# EAGLE design pc_afe4400_shield (EAGLE 6.4)

## Sheet 1 of 2
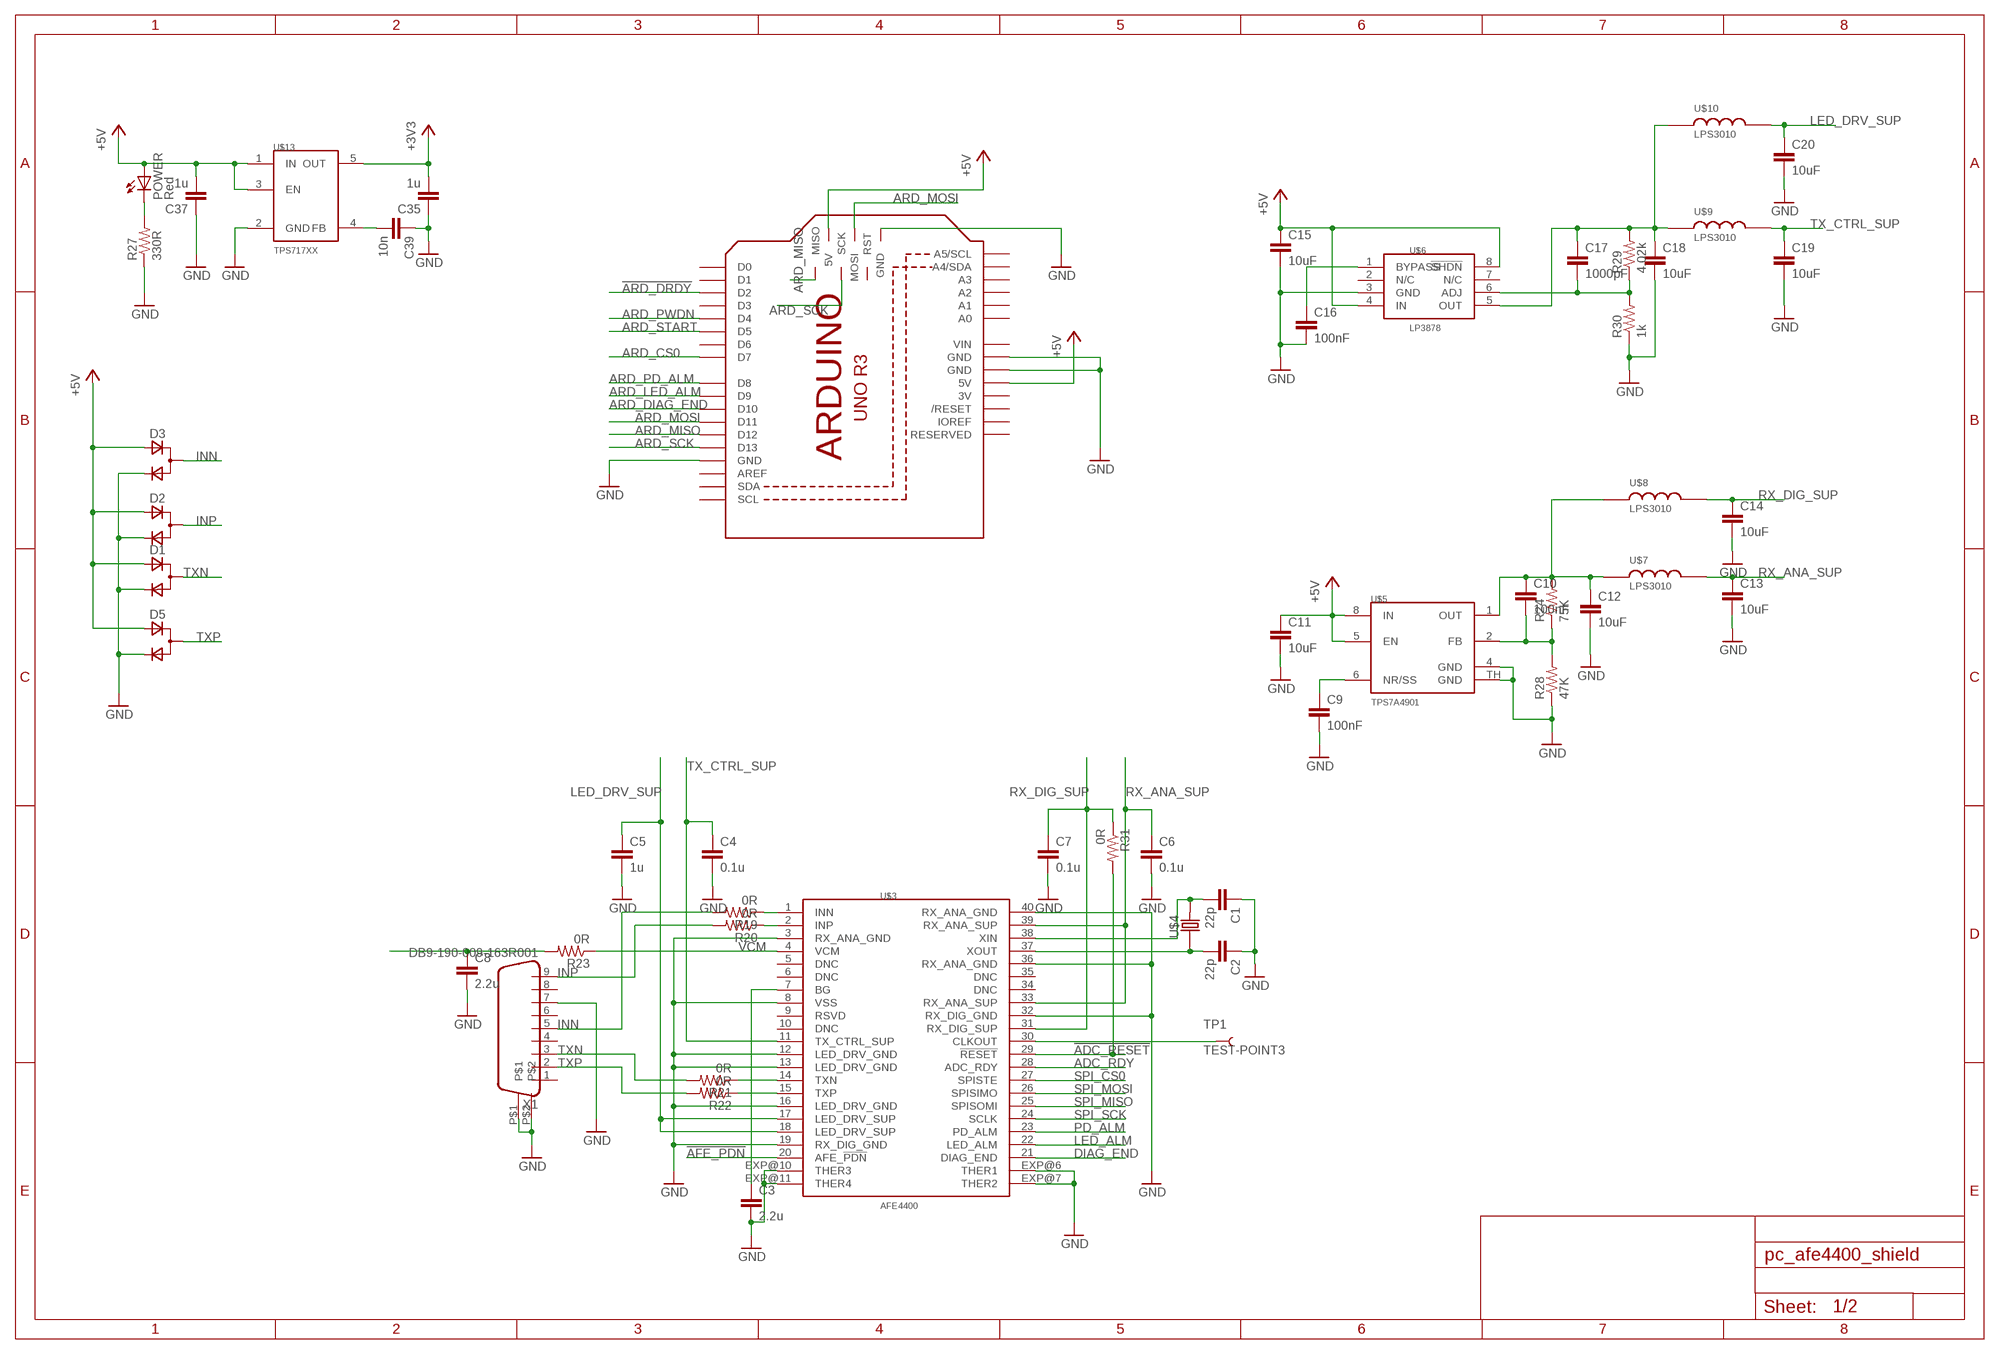
[diagram p0: schematic, sheet 1]

### Parts
C1  22p  C-EUC0402  [C0402]
C2  22p  C-EUC0402  [C0402]
C3  2.2u  C-EUC0402  [C0402]
C4  0.1u  C-EUC0805  [C0805]
C5  1u  C-EUC0805  [C0805]
C6  0.1u  C-EUC0805  [C0805]
C7  0.1u  C-EUC0805  [C0805]
C8  2.2u  C-EUC0402  [C0402]
C9  100nF  C-EUC0805  [C0805]
C10  100nF  C-EUC0805  [C0805]
C11  10uF  C-EUC0805  [C0805]
C12  10uF  C-EUC0805  [C0805]
C13  10uF  C-EUC0805  [C0805]
C14  10uF  C-EUC0805  [C0805]
C15  10uF  C-EUC0805  [C0805]
C16  100nF  C-EUC0805  [C0805]
C17  1000pF  C-EUC0805  [C0805]
C18  10uF  C-EUC0805  [C0805]
C19  10uF  C-EUC0805  [C0805]
C20  10uF  C-EUC0805  [C0805]
C35  1u  C-EUC0805  [C0805]
C37  1u  C-EUC0805  [C0805]
C39  10n  C-EUC0805  [C0805]
D1  D_ACACSOT323  [SOT323]
D2  D_ACACSOT323  [SOT323]
D3  D_ACACSOT323  [SOT323]
D5  D_ACACSOT323  [SOT323]
M1  ARDUINO  [ARDUINO]
POWER  Red  LEDCHIPLED_0603  [CHIPLED_0603]
R19  0R  R-US_R0402  [R0402]
R20  0R  R-US_R0402  [R0402]
R21  0R  R-US_R0805  [R0805]
R22  0R  R-US_R0805  [R0805]
R23  0R  R-US_R0402  [R0402]
R24  75K  R-US_R0805  [R0805]
R27  330R  R-US_R0805  [R0805]
R28  47K  R-US_R0805  [R0805]
R29  4.02k  R-US_R0805  [R0805]
R30  1k  R-US_R0805  [R0805]
R31  0R  R-US_R0805  [R0805]
TP1  TEST-POINT3  [PAD.03X.03]
U$3  AFE4400  [QFN-40]
U$4  ABM3  [ABM3]
U$5  TPS7A4901  [S-PDSO-G08]
U$6  LP3878  [DDA]
U$7  LPS3010  LPS  [LPS]
U$8  LPS3010  LPS  [LPS]
U$9  LPS3010  LPS  [LPS]
U$10  LPS3010  LPS  [LPS]
U$13  TPS717XX  [SC70-5]
X1  DB9-190-009-163R001  [DB9-190-009-163R001]

### Nets
!ADC_RESET: R31.2 U$3.29(!RESET) ; also sheet 2
!AFE_PDN: U$3.20(AFE_!PDN) ; also sheet 2
!ARD_DRDY: M1.D2 ; also sheet 2
+3V3: C35.2 U$13.5(OUT) ; also sheet 2
+5V: C11.1 C15.1 C37.2 D1.3(A) D2.3(A) D3.3(A) D5.3(A) M1.5V M1.5V_ICSP(5V) POWER.A U$5.5(EN) U$5.8(IN) U$6.4(IN) U$6.8(!SHDN) U$13.1(IN) U$13.3(EN) ; also sheet 2
ADC_RDY: U$3.28(ADC_RDY) ; also sheet 2
ARD_CS0: M1.D7 ; also sheet 2
ARD_DIAG_END: M1.D10 ; also sheet 2
ARD_LED_ALM: M1.D9 ; also sheet 2
ARD_MISO: M1.D12 M1.MISO ; also sheet 2
ARD_MOSI: M1.D11 M1.MOSI ; also sheet 2
ARD_PD_ALM: M1.D8 ; also sheet 2
ARD_PWDN: M1.D4 ; also sheet 2
ARD_SCK: M1.D13 M1.SCK ; also sheet 2
ARD_START: M1.D5 ; also sheet 2
DIAG_END: U$3.21(DIAG_END) ; also sheet 2
GND: C1.1 C2.1 C3.2 C4.2 C5.2 C6.2 C7.2 C8.2 C9.2 C11.2 C12.2 C13.2 C14.2 C15.2 C16.2 C18.2 C19.2 C20.2 C35.1 C37.1 C39.1 D1.2(C) D2.2(C) D3.2(C) D5.2(C) M1.GND M1.GND@1(GND) M1.GND@2(GND) M1.GND@3(GND) R27.1 R28.1 R30.1 U$3.3(RX_ANA_GND) U$3.8(VSS) U$3.12(LED_DRV_GND) U$3.13(LED_DRV_GND) U$3.16(LED_DRV_GND) U$3.19(RX_DIG_GND) U$3.32(RX_DIG_GND) U$3.36(RX_ANA_GND) U$3.40(RX_ANA_GND) U$3.EXP@6(THER1) U$3.EXP@7(THER2) U$3.EXP@10(THER3) U$3.EXP@11(THER4) U$5.4(GND) U$5.TH(GND) U$6.3(GND) U$13.2(GND) X1.7 X1.P$1 X1.P$2
INN: D3.1(CA) R19.2 X1.5
INP: D2.1(CA) R20.2 X1.9
LED_ALM: U$3.22(LED_ALM) ; also sheet 2
LED_DRV_SUP: C5.1 C20.1 U$3.17(LED_DRV_SUP) U$3.18(LED_DRV_SUP) U$10.2
N$1: C39.2 U$13.4(FB)
N$2: C3.1 U$3.7(BG)
N$4: R21.1 U$3.14(TXN)
N$5: TP1.P$1 U$3.30(CLKOUT)
N$6: R22.1 U$3.15(TXP)
N$7: POWER.C R27.2
N$8: R19.1 U$3.1(INN)
N$9: C8.1 R23.2
N$10: C1.2 U$3.38(XIN) U$4.2
N$11: C2.2 U$3.37(XOUT) U$4.1
N$14: C16.1 U$6.1(BYPASS)
N$15: C9.1 U$5.6(NR/SS)
N$16: C17.1 C18.1 R29.2 U$6.5(OUT) U$9.1 U$10.1
N$17: R20.1 U$3.2(INP)
N$19: C10.1 C12.1 R24.2 U$5.1(OUT) U$7.1 U$8.1
N$20: C10.2 R24.1 R28.2 U$5.2(FB)
N$22: C17.2 R29.1 R30.2 U$6.6(ADJ)
PD_ALM: U$3.23(PD_ALM) ; also sheet 2
RX_ANA_SUP: C6.1 C13.1 U$3.33(RX_ANA_SUP) U$3.39(RX_ANA_SUP) U$7.2
RX_DIG_SUP: C7.1 C14.1 R31.1 U$3.31(RX_DIG_SUP) U$8.2
SPI_CS0: U$3.27(SPISTE) ; also sheet 2
SPI_MISO: U$3.25(SPISOMI) ; also sheet 2
SPI_MOSI: U$3.26(SPISIMO) ; also sheet 2
SPI_SCK: U$3.24(SCLK) ; also sheet 2
TX_CTRL_SUP: C4.1 C19.1 U$3.11(TX_CTRL_SUP) U$9.2
TXN: D1.1(CA) R21.2 X1.3
TXP: D5.1(CA) R22.2 X1.2
VCM: R23.1 U$3.4(VCM)
Unconnected: M1.A0 M1.A1 M1.A2 M1.A3 M1.A4(A4/SDA) M1.A5(A5/SCL) M1.AREF M1.D0 M1.D1 M1.D3 M1.D6 M1.IOREF M1.RESERVED M1.RESET(/RESET) M1.RESET_ICSP(RST) M1.SCL M1.SDA U$3.5(DNC) U$3.6(DNC) U$3.9(RSVD) U$3.10(DNC) U$3.34(DNC) U$3.35(DNC) U$6.2(N/C) U$6.7(N/C) X1.1 X1.4 X1.6 X1.8

## Sheet 2 of 2
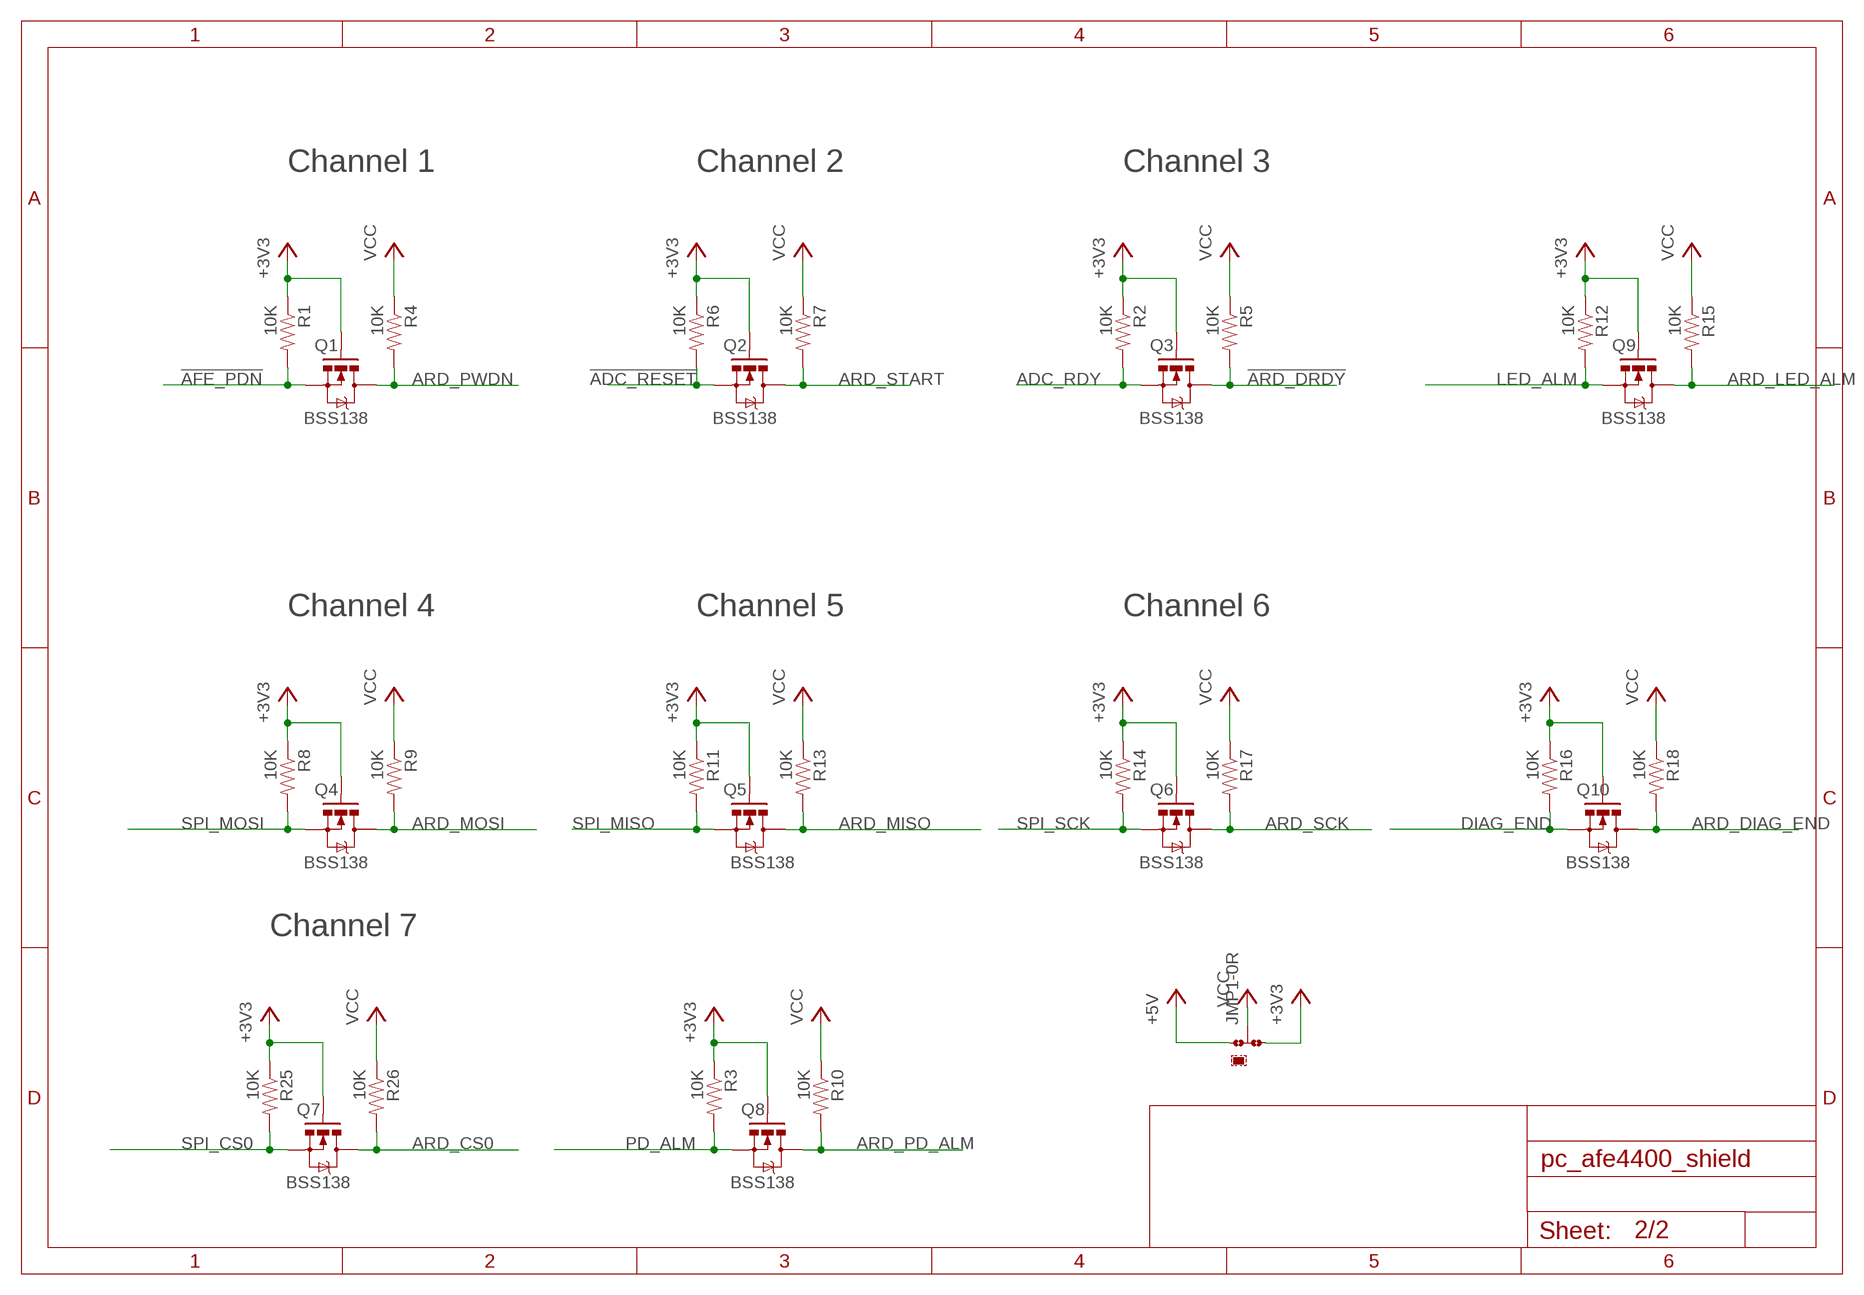
[diagram p1: schematic, sheet 2]

### Parts
JMP1  0R-JUMPA  [A0R-JMP]
Q1  BSS138  MOSFET-NCHANNELSMD  [SOT23-3]
Q2  BSS138  MOSFET-NCHANNELSMD  [SOT23-3]
Q3  BSS138  MOSFET-NCHANNELSMD  [SOT23-3]
Q4  BSS138  MOSFET-NCHANNELSMD  [SOT23-3]
Q5  BSS138  MOSFET-NCHANNELSMD  [SOT23-3]
Q6  BSS138  MOSFET-NCHANNELSMD  [SOT23-3]
Q7  BSS138  MOSFET-NCHANNELSMD  [SOT23-3]
Q8  BSS138  MOSFET-NCHANNELSMD  [SOT23-3]
Q9  BSS138  MOSFET-NCHANNELSMD  [SOT23-3]
Q10  BSS138  MOSFET-NCHANNELSMD  [SOT23-3]
R1  10K  RESISTOR0805-RES  [0805]
R2  10K  RESISTOR0805-RES  [0805]
R3  10K  RESISTOR0805-RES  [0805]
R4  10K  RESISTOR0805-RES  [0805]
R5  10K  RESISTOR0805-RES  [0805]
R6  10K  RESISTOR0805-RES  [0805]
R7  10K  RESISTOR0805-RES  [0805]
R8  10K  RESISTOR0805-RES  [0805]
R9  10K  RESISTOR0805-RES  [0805]
R10  10K  RESISTOR0805-RES  [0805]
R11  10K  RESISTOR0805-RES  [0805]
R12  10K  RESISTOR0805-RES  [0805]
R13  10K  RESISTOR0805-RES  [0805]
R14  10K  RESISTOR0805-RES  [0805]
R15  10K  RESISTOR0805-RES  [0805]
R16  10K  RESISTOR0805-RES  [0805]
R17  10K  RESISTOR0805-RES  [0805]
R18  10K  RESISTOR0805-RES  [0805]
R25  10K  RESISTOR0805-RES  [0805]
R26  10K  RESISTOR0805-RES  [0805]

### Nets
!ADC_RESET: Q2.2(S) R6.2 ; also sheet 1
!AFE_PDN: Q1.2(S) R1.2 ; also sheet 1
!ARD_DRDY: Q3.3(D) R5.2 ; also sheet 1
+3V3: JMP1.3 Q1.1(G) Q2.1(G) Q3.1(G) Q4.1(G) Q5.1(G) Q6.1(G) Q7.1(G) Q8.1(G) Q9.1(G) Q10.1(G) R1.1 R2.1 R3.1 R6.1 R8.1 R11.1 R12.1 R14.1 R16.1 R25.1 ; also sheet 1
+5V: JMP1.1 ; also sheet 1
ADC_RDY: Q3.2(S) R2.2 ; also sheet 1
ARD_CS0: Q7.3(D) R26.2 ; also sheet 1
ARD_DIAG_END: Q10.3(D) R18.2 ; also sheet 1
ARD_LED_ALM: Q9.3(D) R15.2 ; also sheet 1
ARD_MISO: Q5.3(D) R13.2 ; also sheet 1
ARD_MOSI: Q4.3(D) R9.2 ; also sheet 1
ARD_PD_ALM: Q8.3(D) R10.2 ; also sheet 1
ARD_PWDN: Q1.3(D) R4.2 ; also sheet 1
ARD_SCK: Q6.3(D) R17.2 ; also sheet 1
ARD_START: Q2.3(D) R7.2 ; also sheet 1
DIAG_END: Q10.2(S) R16.2 ; also sheet 1
LED_ALM: Q9.2(S) R12.2 ; also sheet 1
PD_ALM: Q8.2(S) R3.2 ; also sheet 1
SPI_CS0: Q7.2(S) R25.2 ; also sheet 1
SPI_MISO: Q5.2(S) R11.2 ; also sheet 1
SPI_MOSI: Q4.2(S) R8.2 ; also sheet 1
SPI_SCK: Q6.2(S) R14.2 ; also sheet 1
VCC: JMP1.2 R4.1 R5.1 R7.1 R9.1 R10.1 R13.1 R15.1 R17.1 R18.1 R26.1

### Notes on the sheet
- Channel 1 | Channel 2 | Channel 3
- Channel 4 | Channel 5 | Channel 6
- Channel 7

## Power pins joined to a net without a drawn wire
3V: M1.3V
VIN: M1.VIN

## Library data of the parts
C1-C20 C35 C37 C39 = rcl:C-EU: CAPACITOR, European symbol
D1-D3 D5 = zetex:D_ACAC: Dual DIODE; OC_FARNELL: unknown; OC_NEWARK: unknown
JMP1 = jump-0r-smd:0R-JUMP: SMD 0R 0805 Jumper
M1 = circuitects:ARDUINO
POWER = led:LED: LED OSRAM: - CHIPLED LG R971, LG N971, LY N971, LG Q971, LY Q971, LO R971, LY R971 LH N974, LH R974 LS Q976, LO Q976, LY Q976 LO Q996 - Hyper CHIPLED LW Q18S LB Q993, LB Q99A, LB R99A - SideLED LS A670, LO A670, LY A670, LG A670, LP A670 LB A673, LV A673, LT A673, LW A673 LH A674 LY A675 LS A676, LA A676, LO A676, LY A676, LW A676 LS A679, LY A679, LG A679 - Hyper Micro SIDELED® LS Y876, LA Y876, LO Y876, LY Y876 LT Y87S - SmartLED LW L88C, LW L88S LB L89C, LB L89S, LG L890 LS L89K, LO L89K, LY L89K LS L896, LA L896, LO L896, LY L896 - TOPLED LS T670, LO T670, LY T670, LG T670, LP T670 LSG T670, LSP T670, LSY T670, LOP T670, LYG T670 LG T671, LOG T671, LSG T671 LB T673, LV T673, LT T673, LW T673 LH T674 LS T676, LA T676, LO T676, LY T676, LB T676, LH T676, LSB T676, LW T676 LB T67C, LV T67C, LT T67C, LS T67K, LO T67K, LY T67K, LW E67C LS E67B, LA E67B, LO E67B, LY E67B, LB E67C, LV E67C, LT E67C LW T67C LS T679, LY T679, LG T679 LS T770, LO T770, LY T770, LG T770, LP T770 LB T773, LV T773, LT T773, LW T773 LH T774 LS E675, LA E675, LY E675, LS T675 LS T776, LA T776, LO T776, LY T776, LB T776 LHGB T686 LT T68C, LB T68C - Hyper Mini TOPLED® LB M676 - Mini TOPLED Santana® LG M470 LS M47K, LO M47K, LY M47K Source: http://www.osram.convergy.de LUXEON: - LUMILED® LXK2-PW12-R00, LXK2-PW12-S00, LXK2-PW14-U00, LXK2-PW14-V00 LXK2-PM12-R00, LXK2-PM12-S00, LXK2-PM14-U00 LXK2-PE12-Q00, LXK2-PE12-R00, LXK2-PE12-S00, LXK2-PE14-T00, LXK2-PE14-U00 LXK2-PB12-K00, LXK2-PB12-L00, LXK2-PB12-M00, LXK2-PB14-N00, LXK2-PB14-P00, LXK2-PB14-Q00 LXK2-PR12-L00, LXK2-PR12-M00, LXK2-PR14-Q00, LXK2-PR14-R00 LXK2-PD12-Q00, LXK2-PD12-R00, LXK2-PD12-S00 LXK2-PH12-R00, LXK2-PH12-S00 LXK2-PL12-P00, LXK2-PL12-Q00, LXK2-PL12-R00 Source: www.luxeon.com KINGBRIGHT: KA-3528ASYC Source: www.kingbright.com
Q1-Q10 = SparkFun:MOSFET-NCHANNEL
R1-R18 R25 R26 = SparkFun:RESISTOR: Resistor Basic schematic elements and footprints for 0603, 1206, and PTH resistors.
R19-R24 R27-R31 = rcl:R-US_: RESISTOR, American symbol
TP1 = SparkFun:TEST-POINT
U$3 = circuitects:AFE4400
U$4 = circuitects:ABM3
U$5 = circuitects:TPS7A4901
U$6 = circuitects:LP3878
U$7-U$10 = circuitects:LPS
U$13 = circuitects:TPS717XX
X1 = circuitects:DB9-190-009-163R001

## Board
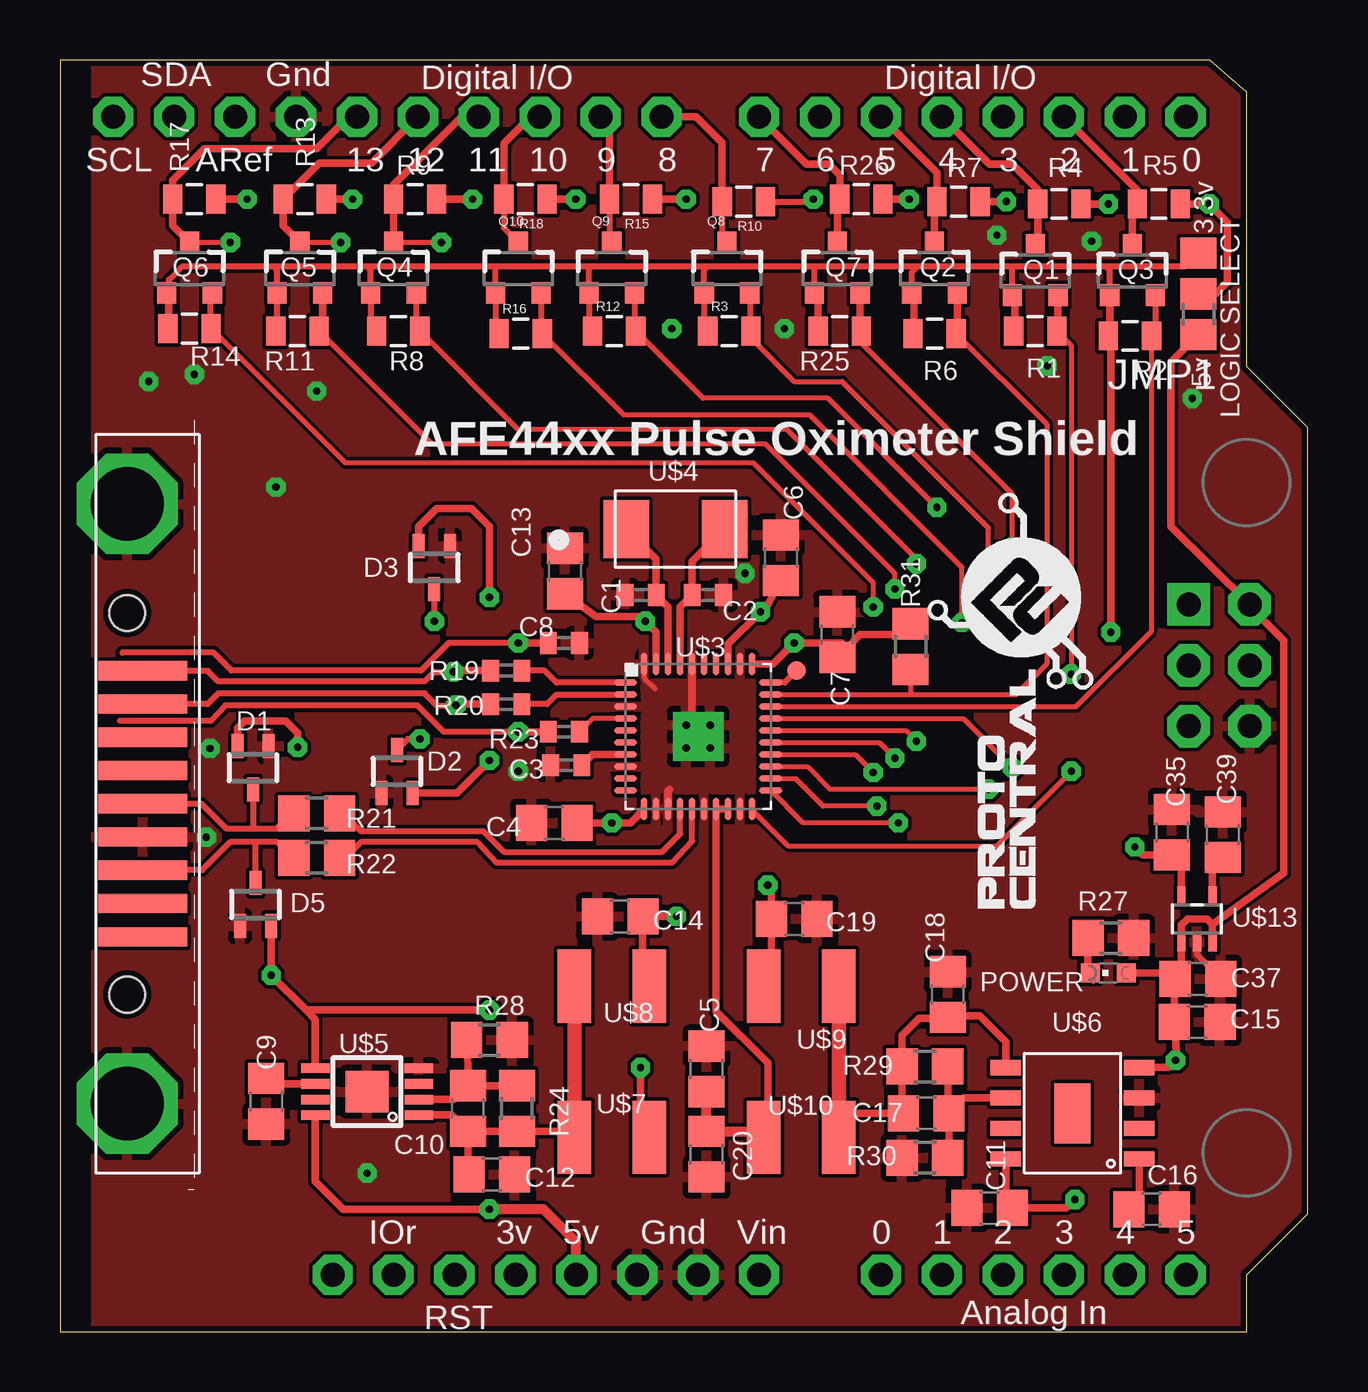
[diagram p2: board, top side]
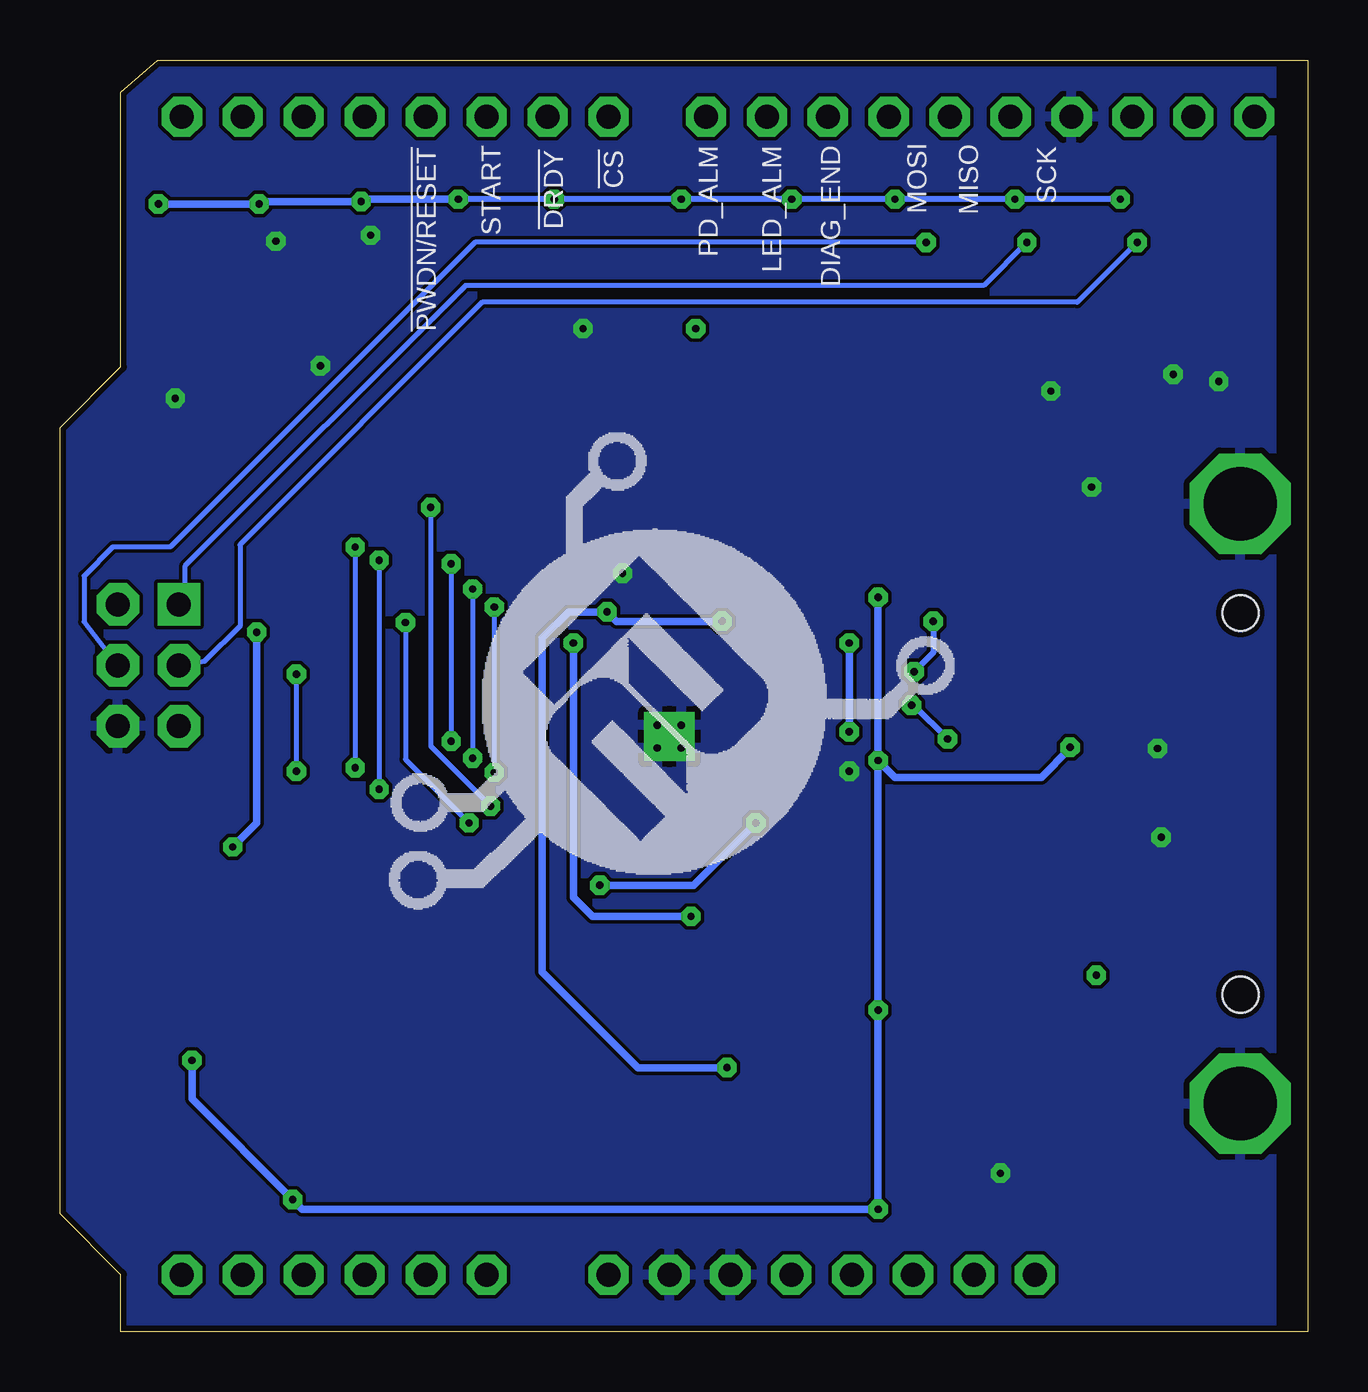
[diagram p3: board, bottom side, seen from below]

Size 52 x 53 mm. Coordinates in mm from the lower left corner, seen from the top.
Copper layers (1*2*15*16): Top 0.035mm / dielectric 1.5mm / Route2 0.035mm / dielectric 0.15mm / Route15 0.035mm / dielectric 0.2mm / Bottom 0.035mm
Design rules "Circuitects-Rules": minimum track width 6mil, minimum drill 0.3mm, track to track 6mil, track to pad 6mil, pad to pad 6mil, via to via 6mil, smd to smd 6mil, copper to edge 10mil, drill to drill 8mil, minimum pad ring 12mil, minimum via ring 10mil, stop-mask expansion 4mil, vias tented up to drill 25mil, thermal gap 10mil

### Footprints (pad centres in the part's own frame; a part is rotated, then mirrored left to right if it is on the bottom)
C0402 = smd 0.7 x 0.9: 1 -0.65,0; 2 0.65,0
C0805 = smd 1.3 x 1.5: 1 -0.95,0; 2 0.95,0
SOT323 = smd 0.5 x 1: 1 0,0.9; 2 -0.65,-0.9; 3 0.65,-0.9
A0R-JMP = smd 1.5 x 1.3: 1 0,1.7; 2 0,0; 3 0,-1.7
ARDUINO = drill 1 pad 1.676 octagon: 3V 18.96,2.34; 5V 21.5,2.34; A0 34.2,2.34; A1 36.74,2.34; A2 39.28,2.34; A3 41.82,2.34; A4 44.36,2.34; A5 46.9,2.34; AREF 7.276,50.6; D0 46.9,50.6; D1 44.36,50.6; D2 41.82,50.6; D3 39.28,50.6; D4 36.74,50.6; D5 34.2,50.6; D6 31.66,50.6; D7 29.12,50.6; D8 25.056,50.6; D9 22.516,50.6; D10 19.976,50.6; D11 17.436,50.6; D12 14.896,50.6; D13 12.356,50.6; GND 9.816,50.6; GND@1 26.58,2.34; GND@2 24.04,2.34; IOREF 13.88,2.34; RESERVED 11.34,2.34; RESET 16.42,2.34; SCL 2.196,50.6; SDA 4.736,50.6; VIN 29.12,2.34 | drill 1 pad 1.778 octagon: 5V_ICSP 49.567,30.28; GND@3 49.567,25.2; MOSI 49.567,27.74; RESET_ICSP 47.027,25.2; SCK 47.027,27.74 | drill 1 pad 1.778 square: MISO 47.027,30.28
CHIPLED_0603 = smd 0.8 x 0.8: A 0,-0.75; C 0,0.75
SOT23-3 = smd 0.8 x 0.9: 1 -0.95,-1; 2 0.95,-1; 3 0,1.1
0805 = smd 0.8 x 1.2: 1 -0.9,0; 2 0.9,0
R0402 = smd 0.7 x 0.9: 1 -0.65,0; 2 0.65,0
R0805 = smd 1.3 x 1.5: 1 -0.95,0; 2 0.95,0
PAD.03X.03 = smd 0.762 x 0.762: P$1 0,0
QFN-40 = smd 0.95 x 0.28: 1 -3.025,2.25; 2 -3.025,1.75; 3 -3.025,1.25; 4 -3.025,0.75; 5 -3.025,0.25; 6 -3.025,-0.25; 7 -3.025,-0.75; 8 -3.025,-1.25; 9 -3.025,-1.75; 10 -3.025,-2.25; 21 3.025,-2.25; 22 3.025,-1.75; 23 3.025,-1.25; 24 3.025,-0.75; 25 3.025,-0.25; 26 3.025,0.25; 27 3.025,0.75; 28 3.025,1.25; 29 3.025,1.75; 30 3.025,2.25 | smd 0.28 x 0.95: 11 -2.25,-3.025; 12 -1.75,-3.025; 13 -1.25,-3.025; 14 -0.75,-3.025; 15 -0.25,-3.025; 16 0.25,-3.025; 17 0.75,-3.025; 18 1.25,-3.025; 19 1.75,-3.025; 20 2.25,-3.025; 31 2.25,3.025; 32 1.75,3.025; 33 1.25,3.025; 34 0.75,3.025; 35 0.25,3.025; 36 -0.25,3.025; 37 -0.75,3.025; 38 -1.25,3.025; 39 -1.75,3.025; 40 -2.25,3.025 | drill 0.3 pad 1.1 square: EXP@6 -0.5,0.475; EXP@7 0.5,0.475; EXP@10 -0.5,-0.475; EXP@11 0.5,-0.475
ABM3 = smd 1.9 x 2.4: 1 -2.05,0; 2 2.05,0
S-PDSO-G08 = smd 0.4 x 1.2: 1 -0.975,-2.157; 2 -0.325,-2.157; 3 0.325,-2.157; 4 0.975,-2.157; 5 0.975,2.157; 6 0.325,2.157; 7 -0.325,2.157; 8 -0.975,2.157 | smd 1.73 x 1.78: TH 0,0
DDA = smd 0.635 x 1.27: 1 -1.905,-2.78; 2 -0.635,-2.78; 3 0.635,-2.78; 4 1.905,-2.78; 5 1.905,2.78; 6 0.635,2.78; 7 -0.636,2.78; 8 -1.905,2.78 | smd 2.5 x 1.5: 9 0,0
LPS = smd 1.4 x 3.05: 1 -1.56,0; 2 1.56,0
SC70-5 = smd 0.35 x 0.8: 1 -0.65,-0.95; 2 0,-0.95; 3 0.65,-0.95; 4 0.65,0.95; 5 -0.65,0.95
DB9-190-009-163R001 = smd 0.8 x 3.7: 1 5.55,0; 2 2.77,0; 3 0,0; 4 -2.77,0; 5 -5.54,0; 6 4.155,0; 7 1.385,0; 8 -1.385,0; 9 -4.155,0 | drill 3.05 pad 4.2 octagon: P$1 -12.5,-0.65; P$2 12.5,-0.65 | hole 1.5: -7.95,-0.65; 7.95,-0.65

### Placement (x,y rotation side)
C1  24.2,30.7 0 top
C2  27,30.7 180 top
C3  21.1,23.6 180 top
C4  20.6,21.2 180 top
C5  26.95,10.95 90 top
C6  30.05,32.25 90 top
C7  32.4,29.05 90 top
C8  21,28.7 0 top
C9  8.6,9.6 270 top
C10  17,9.3 90 top
C11  38.75,5.15 180 top
C12  18,6.55 0 top
C13  21.05,31.7 90 top
C14  23.35,17.3 180 top
C15  47.4,12.9 0 top
C16  45.5,5.1 0 top
C17  36.1,9.1 0 top
C18  37,14.05 90 top
C19  30.6,17.2 0 top
C20  26.95,7.4 270 top
C35  46.35,20.81 270 top
C37  47.43,14.7 180 top
C39  48.47,20.71 270 top
D1  8.05,23.5 180 top
D2  14.05,23.35 0 top
D3  15.6,31.85 180 top
D5  8.15,17.8 0 top
JMP1  47.45,43.25 180 top
M1  0.02,0.03 0 top
POWER  43.7,14.95 90 top
Q1  40.65,44.2 0 top
Q2  36.45,44.3 0 top
Q3  44.7,44.2 0 top
Q4  13.9,44.3 0 top
Q5  10,44.3 0 top
Q6  5.4,44.3 0 top
Q7  32.4,44.3 0 top
Q8  27.8,44.3 0 top
Q9  23,44.3 0 top
Q10  19.1,44.3 0 top
R1  40.65,41.7 0 top
R2  44.6,41.5 0 top
R3  27.9,41.7 0 top
R4  41.65,47 180 top
R5  45.8,47 180 top
R6  36.45,41.6 0 top
R7  37.45,47.1 180 top
R8  14.1,41.7 0 top
R9  14.8,47.2 180 top
R10  28.5,47.1 180 top
R11  9.9,41.7 0 top
R12  23.1,41.7 0 top
R13  10.2,47.2 180 top
R14  5.4,41.8 0 top
R15  23.8,47.2 180 top
R16  19.2,41.6 0 top
R17  5.6,47.2 180 top
R18  19.4,47.2 180 top
R19  18.6,27.55 180 top
R20  18.6,26.15 180 top
R21  10.7,21.6 180 top
R22  10.7,19.75 180 top
R23  21,25 180 top
R24  19.05,9.3 270 top
R25  32.5,41.7 0 top
R26  33.4,47.2 180 top
R27  43.8,16.4 180 top
R28  17.9,12.15 180 top
R29  36.05,11.05 180 top
R30  36.05,7.25 0 top
R31  35.45,28.55 270 top
TP1  30.7,27.55 0 top
U$1  [PROTY_WITH_TEXT]  43.1,16.55 90 top
U$2  [PROTY-LOGO-LARGE]  38.5,17.25 0 bottom
U$3  26.6,24.8 0 top
U$4  25.65,33.45 180 top
U$5  12.8,10 90 top
U$6  42.2,9.1 90 top
U$7  23,8.1 0 top
U$8  23,14.4 0 top
U$9  30.9,14.4 180 top
U$10  30.9,8.1 180 top
U$13  47.39,17.2 0 top
X1  3.45,22 270 top

### Tracks (layer width: path | path; a pad name or v marks a point on that pad's centre or on a via)
!ADC_RESET
  Top 0.2: U$3.29 35.55,26.55 | 35.55,26.55 39.85,26.55 41.15,27.85 41.15,37.8 R6.2 | R31.2 35.45,26.65 35.55,26.55
  Top 0.305: Q2.2 37.4,41.65 R6.2
!AFE_PDN  (via drill 0.3)
  Top 0.2: U$3.20 28.85,21.75 30.35,20.25 39.05,20.25 v42.15,23.35 | R1.2 42.15,41.1 v42.15,27.4
  Top 0.305: Q1.2 41.6,41.75 R1.2
  Bottom 0.2: v42.15,27.4 v42.15,23.35
!ARD_DRDY
  Top 0.305: Q3.3 44.7,46.95 R5.2 44.9,47.57 M1.D2
+3V3  (via drill 0.3)
  Top 0.254: Q6.1 4.55,43.2 4.55,43.85 5.1,44.4 8.9,44.4 | 35.6,43.2 Q2.1 35.5,44.15 35.75,44.4 | R8.1 12.95,42 Q4.1 12.95,44.25 12.8,44.4 | 8.9,44.4 12.8,44.4 | 12.8,44.4 18.1,44.4 | 18.1,44.4 22,44.4 | 22,44.4 27,44.4 | 27,44.4 31.5,44.4 | Q7.1 31.45,44.35 31.5,44.4 | 8.9,44.4 9.05,44.25 Q5.1 R11.1 | R16.1 18.15,41.75 Q10.1 18.15,44.35 18.1,44.4 | R12.1 22.05,41.85 Q9.1 22.05,44.35 22,44.4 | 27,44.4 26.85,44.25 Q8.1 26.85,41.85 R3.1 | 31.5,44.4 35.75,44.4 | 35.75,44.4 39.7,44.4 | 39.7,44.4 43.6,44.4 | 43.6,44.4 46.9,44.4 JMP1.3 | Q3.1 43.75,44.25 43.6,44.4 | 39.7,44.4 Q1.1 39.8,43.1
  Top 0.305: 4.55,43.2 R14.1 | R25.1 31.6,43.15 Q7.1 | 35.6,43.2 35.6,41.65 R6.1 | 39.8,43.1 39.8,41.75 R1.1 | Q3.1 43.75,41.55 R2.1 43.8,41.4 v43.8,29.15 | v44.8,20.2 45.14,19.86 C35.2 46.74,19.47 U$13.5
  Bottom 0.305: v43.8,29.15 43.8,21.2 v44.8,20.2
+5V  (via drill 0.3)
  Top 0.305: U$13.3 48.04,16.96 | 48.04,16.96 47.8,17.2 47,17.2 46.74,16.94 U$13.1 46.74,14.99 C37.2 | U$5.8 10.64,6.26 11.8,5.1 v17.9,5.1 | 48.04,16.96 51,19.12 51,28.8 49.37,30.43 M1.5V_ICSP 46.3,33.55 46.3,40.4 JMP1.1 | U$6.4 46.2,11.01 v46.5,11.3 46.55,11.35 C15.1 46.45,14.67 C37.2 | U$5.5 10.64,13.01 10.25,13.4 | 10.25,13.4 v8.8,14.85 D5.3 | v17.9,13.4 10.25,13.4 | D1.3 7.4,25.15 7.7,25.45 9.4,25.45 9.9,24.95 v9.9,24.35 | D2.3 16.55,22.45 v17.9,23.8 | D3.3 14.95,33.55 15.7,34.3 17.15,34.3 17.9,33.55 v17.9,30.6 | v42.3,5.5 41.95,5.15 C11.1 39.42,5.43 U$6.8 | POWER.A 46.23,14.95 C37.2
  Top 0.406: M1.5V 21.52,3.73 20.15,5.1 v17.9,5.1
  Bottom 0.305: v17.9,30.6 v17.9,23.8 | v17.9,23.8 v17.9,13.4 v17.9,5.1 41.9,5.1 v42.3,5.5 46.5,9.7 v46.5,11.3 | v9.9,24.35 9.9,24.3 11.1,23.1 17.2,23.1 v17.9,23.8
ADC_RDY
  Top 0.2: U$3.28 42.35,26.05 45.5,29.2 R2.2
  Top 0.254: Q3.2 45.65,41.65 R2.2
ARD_CS0
  Top 0.305: Q7.3 32.4,47.05 R26.2 32.5,48.2 32.05,48.65 31.12,48.65 M1.D7
ARD_DIAG_END
  Top 0.254: R18.2 18.5,46 Q10.3
  Top 0.305: R18.2 18.5,49.52 19.61,50.63 M1.D10
ARD_LED_ALM
  Top 0.254: R15.2 22.9,45.5 Q9.3
  Top 0.305: R15.2 22.9,50.27 M1.D9
ARD_MISO  (via drill 0.3)
  Top 0.2: Q5.3 v11.7,45.4
  Top 0.305: Q5.3 9.3,46.1 R13.2 10.8,48.7 12.99,48.7 M1.D12
  Bottom 0.2: v11.7,45.4 13.5,43.6 35.1,43.6 46.8,31.9 46.8,30.51 M1.MISO
ARD_MOSI  (via drill 0.3)
  Top 0.2: Q4.3 v15.9,45.4
  Top 0.305: Q4.3 R9.2 13.9,47.8 16.73,50.63 M1.D11
  Bottom 0.2: v15.9,45.4 34.7,45.4 47.4,32.7 49.8,32.7 51,31.5 51,29.57 M1.MOSI
ARD_PD_ALM
  Top 0.254: R10.2 27.6,45.6 Q8.3
  Top 0.305: R10.2 27.6,49.55 26.52,50.63 M1.D8
ARD_PWDN
  Top 0.305: Q1.3 40.75,45.4 R4.2 40.75,47.6 39.7,48.65 38.74,48.65 M1.D4
ARD_SCK  (via drill 0.3)
  Top 0.2: Q6.3 v7.1,45.4
  Top 0.305: Q6.3 4.7,46.1 R17.2 4.7,48 6,49.3 10.7,49.3 12.03,50.63 M1.D13
  Bottom 0.2: v7.1,45.4 9.6,42.9 34.4,42.9 44.5,32.8 44.5,29.4 45.96,27.94 M1.SCK
ARD_START
  Top 0.305: Q2.3 36.45,46.95 R7.2 36.55,48.3 M1.D5
DIAG_END  (via drill 0.3)
  Top 0.2: v34.95,21.2 30.98,21.2 U$3.21 | R16.2 23.5,38.2 31.25,38.2 37.6,31.85 v37.6,29.55
  Top 0.254: Q10.2 20.05,41.65 R16.2
  Bottom 0.2: v37.6,29.55 37.6,23.85 v34.95,21.2
GND  (via drill 0.3)
  Top 0.2: U$3.40 24.35,27.25 24.8,26.8
  Top 0.254: C37.1 48.08,15.02 47.4,15.7 U$13.2
  Top 0.305: U$3.36 26.35,25.52 U$3.EXP@6 | U$3.13 25.35,22.55 25.4,22.6
  Bottom 0.305: U$3.EXP@10 U$3.EXP@11 U$3.EXP@7 U$3.EXP@6
  other vias: 41.15,40.25 12.8,6.6 3.7,39.6 47.2,38.9 9,35.2 39.05,45.7 43,45.45 30.2,41.8 10.7,39.2 5.6,39.9 19.1,23.35 6.1,20.6 6.25,24.3 28.55,31.6
  pour Top: 1.5,53.4 51.8,53.3 51.8,0 1.5,0
  pour Bottom: 1.5,53.5 52,53.3 51.9,-0.2 1.5,-0.1
INN  (via drill 0.3)
  Top 0.254: 3.54,27.5 X1.5 6.16,27.54 6.6,27.1 15.2,27.1 15.6,27.5 v16.4,27.5 | D3.1 v15.6,29.6
  Top 0.305: R19.2 16.45,27.55 v16.4,27.5 16.36,27.54
  Bottom 0.254: v15.6,29.6 15.6,28.3 v16.4,27.5
INP  (via drill 0.3)
  Top 0.254: X1.9 6.16,26.16 6.6,26.6 15.2,26.6 15.7,26.1 v16.5,26.1 | D2.1 14.5,24.7 v15,24.7
  Top 0.305: R20.2 16.55,26.15 v16.5,26.1 16.45,26.16
  Bottom 0.254: v15,24.7 16.4,26.1 v16.5,26.1
LED_ALM  (via drill 0.3)
  Top 0.2: v34.05,21.9 31.8,21.9 30.65,23.05 U$3.22 | v36.55,34.35 32,38.9 26.8,38.9 R12.2
  Top 0.254: Q9.2 23.95,41.75 R12.2
  Bottom 0.2: v36.55,34.35 36.55,24.4 v34.05,21.9
LED_DRV_SUP
  Top 0.305: U$3.18 U$3.17 27.35,13.35 29.5,11.2 29.5,8.23 U$10.2
  Top 0.406: C5.1 C20.1 29.38,8.35 U$10.2
N$1
  Top 0.305: U$13.4 48.04,19.33 C39.2
N$2
  Top 0.305: U$3.7 22.2,24.05 C3.1
N$4
  Top 0.254: R21.1 12.2,21.2 12.55,20.85 17.65,20.85 18.5,20 25.1,20 25.85,20.75 U$3.14
N$5
  Top 0.254: TP1.P$1 30.2,27.05 U$3.30
N$6
  Top 0.254: R22.1 12.2,20.05 12.55,20.4 17.4,20.4 18.2,19.55 25.5,19.55 26.35,20.45 U$3.15
N$7
  Top 0.305: R27.2 42.85,15.05 POWER.C
N$8
  Top 0.254: U$3.1 20.7,27.05 20.2,27.55 R19.1
N$9  (via drill 0.3)
  Top 0.254: v19.1,25 16,25 14.9,26.1 6.9,26.1 6.3,25.45 2.5,25.45 | v19.1,28.7 16.2,28.7 15.05,27.55 7.15,27.55 6.4,28.3 2.6,28.3
  Top 0.305: R23.2 v19.1,25 | C8.1 v19.1,28.7
  Bottom 0.305: v19.1,28.7 v19.1,25
N$10
  Top 0.305: U$3.38 25.35,30.2 C1.2 24.85,32.2 U$4.2
N$11
  Top 0.305: U$3.37 25.85,30.2 C2.2 26.35,32.1 U$4.1
N$14
  Top 0.305: U$6.1 44.98,5.53 C16.1
N$15
  Top 0.305: U$5.6 8.68,10.32 C9.1
N$16
  Top 0.305: U$6.5 39.42,12.08 38.35,13.15 37.05,13.15 C18.1 36.95,13.05 35.8,13.05 35.1,12.35 R29.2 35.1,9.15 C17.1 32.51,9.1 32.46,9.15
  Top 0.61: U$10.1 32.46,9.15 U$9.1
N$17
  Top 0.254: U$3.2 20.7,26.55 20.3,26.15 R20.1
N$19
  Top 0.305: C10.1 R24.2 21.09,8.35 21.44,8.7 | U$5.1 16.32,9.03 C10.1 | C10.1 17,6.6 C12.1
  Top 0.61: U$7.1 21.44,8.7 U$8.1
N$20
  Top 0.305: R24.1 C10.2 | C10.2 17,11.05 R28.2 | U$5.2 16.43,9.68 C10.2
N$22
  Top 0.305: R29.1 37,9.15 C17.2 | U$6.6 37.69,9.73 C17.2 | C17.2 37.05,7.3 R30.2
N$107  (via drill 0.3)
  other vias: 25.5,41.8
PD_ALM  (via drill 0.3)
  Top 0.2: R3.2 28.8,41.3 28.9,41.3 30.6,39.6 32.6,39.6 38.7,33.5 v38.7,32.15 | v38.7,22.6 32.1,22.6 31.15,23.55 U$3.23
  Top 0.254: Q8.2 28.75,41.75 R3.2
  Bottom 0.2: v38.7,32.15 v38.7,22.6
RX_ANA_SUP  (via drill 0.3)
  Top 0.305: U$3.39 24.85,29.15 v24.4,29.6 24.2,29.8 22.35,29.8 C13.1 | U$3.33 27.85,28.65 v29.2,30 29.5,30.3 C6.1 | v24.2,11 24.2,8.17 U$7.2
  Bottom 0.305: v24.2,11 27.9,11 31.9,15 31.9,28.9 30.8,30 v29.2,30 28.8,29.6 v24.4,29.6
RX_DIG_SUP  (via drill 0.3)
  Top 0.305: U$8.2 24.25,14.42 C14.1 v25.7,17.3 | U$3.31 29.73,27.82 v30.6,28.7 32.6,28.7 32.8,28.5 | R31.1 35.25,29.5 34.8,29.05 33.35,29.05 32.8,28.5 | 32.8,28.5 C7.1
  Bottom 0.305: v30.6,28.7 30.6,18.1 29.8,17.3 v25.7,17.3
SPI_CS0  (via drill 0.3)
  Top 0.2: R25.2 33.4,41.2 39.7,34.9 v39.7,32.7 | U$3.27 37.65,25.55 v39.7,23.5
  Top 0.305: Q7.2 33.35,41.75 R25.2
  Bottom 0.2: v39.7,32.7 v39.7,23.5
SPI_MISO  (via drill 0.3)
  Top 0.2: 10.8,41.5 R11.2 15.5,37 29.4,37 34.8,31.6 v34.8,30.95 | U$3.25 34.15,24.55 v34.8,23.9
  Top 0.305: Q5.2 10.95,41.9 R11.2
  Bottom 0.2: v34.8,30.95 v34.8,23.9
SPI_MOSI  (via drill 0.3)
  Top 0.2: 15,41.5 R8.2 19.1,37.6 30.3,37.6 35.7,32.2 v35.7,32 | U$3.26 35.25,25.05 v35.7,24.6
  Top 0.254: 14.8,41.65 R8.2 14.85,41.8 Q4.2
  Bottom 0.2: v35.7,32 v35.7,24.6
SPI_SCK  (via drill 0.3)
  Top 0.2: 6.3,41.4 R14.2 11.9,36.2 28.9,36.2 33.9,31.2 v33.9,30.2 | U$3.24 33.15,24.05 v33.9,23.3
  Top 0.254: R14.2 6.25,43.2 Q6.2
  Bottom 0.2: v33.9,30.2 v33.9,23.3
TX_CTRL_SUP  (via drill 0.3)
  Top 0.305: U$9.2 29.65,14.42 C19.1 29.65,18.45 v29.5,18.6 | U$3.11 23.77,21.2 v23,21.2 C4.1
  Bottom 0.305: v29.5,18.6 25.6,18.6 v23,21.2
TXN
  Top 0.254: R21.2 9.25,21.2 9,20.95 8,20.95 | 8,20.95 6.95,20.95 5.9,22 X1.3 | D1.1 8.05,21 8,20.95
TXP
  Top 0.254: R22.2 9.4,20.05 9.05,20.4 8.1,20.4 | 8.1,20.4 7.1,20.4 5.93,19.23 X1.2 | D5.1 8.15,20.35 8.1,20.4
VCC  (via drill 0.3)
  Top 0.254: R10.1 31.3,47.1 v31.4,47.2
  Top 0.305: R26.1 v35.4,47.2 | R15.1 v26.1,47.2 | R18.1 v21.5,47.2 | R9.1 v17.2,47.2 | R13.1 v12.2,47.2 | R17.1 v7.8,47.2 | JMP1.2 48.15,43.25 48.65,43.75 48.65,46.25 v47.9,47 R5.1 | R7.1 v39.45,47.1 | R4.1 v43.7,47
  Bottom 0.254: v7.8,47.2 v12.2,47.2 v17.2,47.2 v21.5,47.2 v26.1,47.2 v31.4,47.2 v35.4,47.2
  Bottom 0.305: v35.4,47.2 39.35,47.2 v39.45,47.1 43.6,47.1 v43.7,47 v47.9,47
VCM
  Top 0.2: U$3.4 22.2,25.55 R23.1

### Text on the board
tPlace: 3.3v | LOGIC SELECT | 5v | AFE44xx Pulse Oximeter Shield
bPlace: MISO | MOSI | SCK | DIAG_END | LED_ALM | PD_ALM | !CS | !DRDY | START | !PWDN/RESET